# Altium project PCB工程.PrjPCB
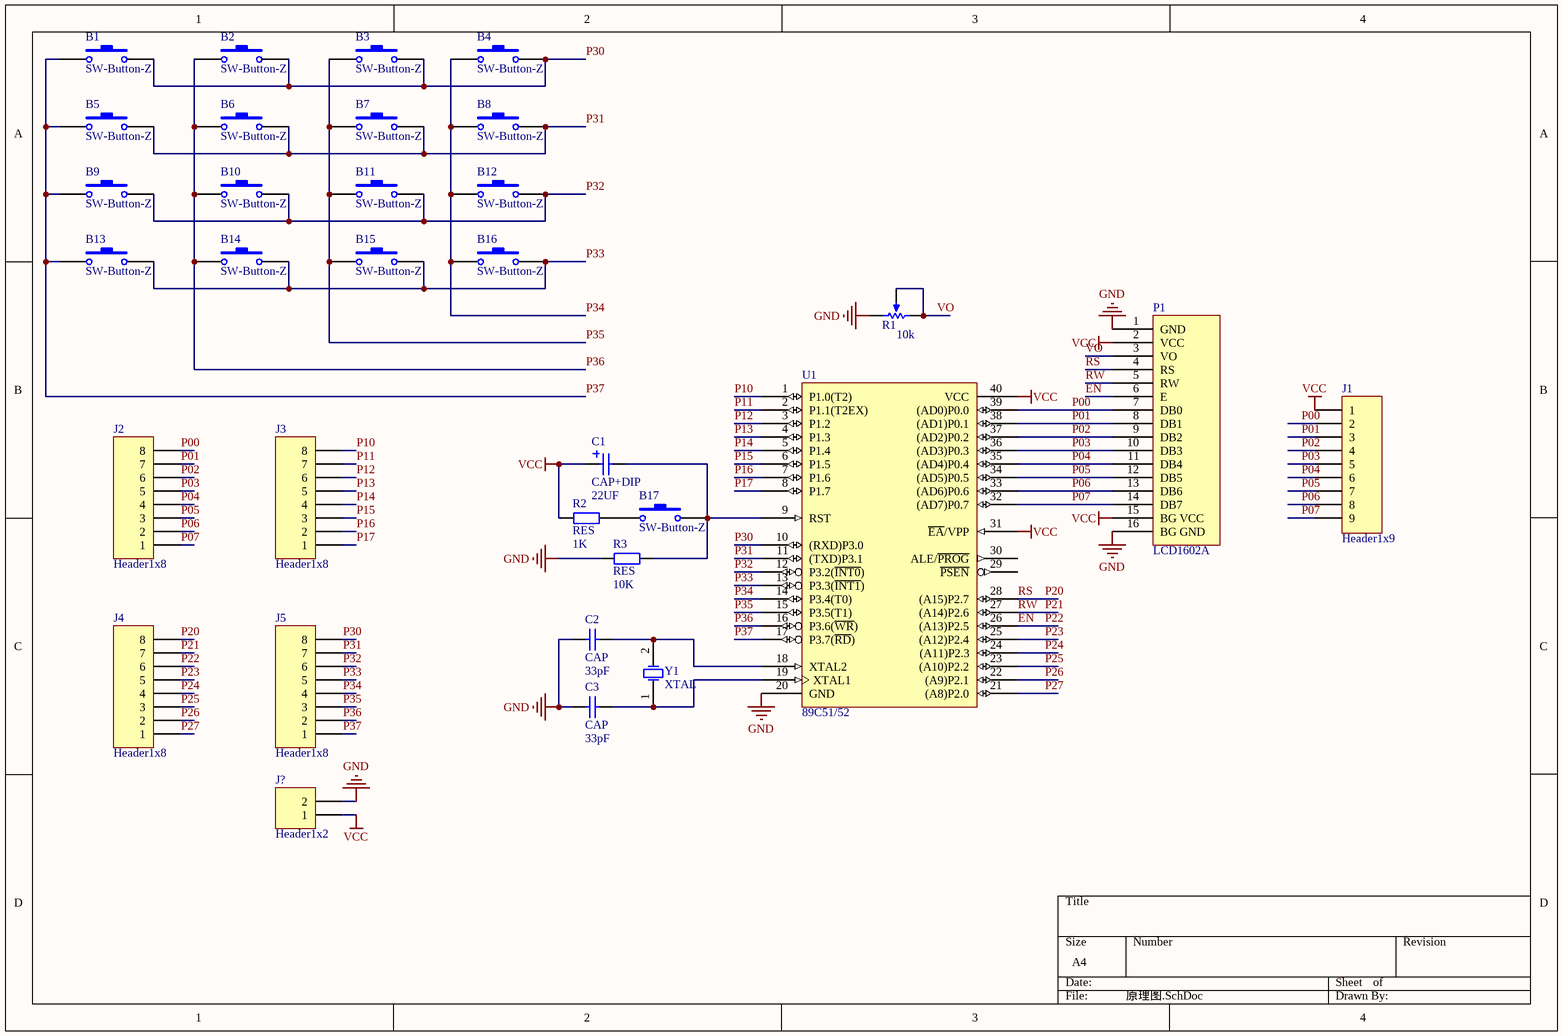
[diagram p0: 原理图.SchDoc]
1 sheet, 32 parts. Net scope: global (net labels, ports and power ports of the same name join across sheets).
Board file: PCB图.PcbDoc

## Sheet 原理图.SchDoc
size A4

### Parts
B1  SW-Button-Z  [SW-PB-Z]
B2  SW-Button-Z  [SW-PB-Z]
B3  SW-Button-Z  [SW-PB-Z]
B4  SW-Button-Z  [SW-PB-Z]
B5  SW-Button-Z  [SW-PB-Z]
B6  SW-Button-Z  [SW-PB-Z]
B7  SW-Button-Z  [SW-PB-Z]
B8  SW-Button-Z  [SW-PB-Z]
B9  SW-Button-Z  [SW-PB-Z]
B10  SW-Button-Z  [SW-PB-Z]
B11  SW-Button-Z  [SW-PB-Z]
B12  SW-Button-Z  [SW-PB-Z]
B13  SW-Button-Z  [SW-PB-Z]
B14  SW-Button-Z  [SW-PB-Z]
B15  SW-Button-Z  [SW-PB-Z]
B16  SW-Button-Z  [SW-PB-Z]
B17  SW-Button-Z  [SW-PB-Z]
C1  CAP+DIP  [CAP+DIP]
C2  CAP  [CAP]
C3  CAP  [CAP]
J1  Header1x9  [HEADER1X9]
J2  Header1x8  [HEADER1X8]
J3  Header1x8  [HEADER1X8]
J4  Header1x8  [HEADER1X8]
J5  Header1x8  [HEADER1X8]
J?  Header1x2  [HEADER1X2]
P1  LCD1602A  [LCD1602A]
R1  RES  [RES-Change-T]  (value not drawn)
R2  RES  [RES]
R3  RES  [RES]
U1  89C51/52  [DIP-40]
Y1  XTAL  [XTAL]

### Nets
GND: C2.1 C3.1 J?.2 P1.1(GND) P1.16(BG_GND) R1.2(BOT) R3.1 U1.20(GND)
VCC: C1.1 J1.1 J?.1 P1.2(VCC) P1.15(BG_VCC) R2.1 U1.31(~{EA}/VPP) U1.40(VCC)
EN: J4.6 P1.6(E) U1.26((A13)P2.5)  [also labelled P22]
P00: J1.2 J2.8 P1.7(DB0) U1.39((AD0)P0.0)
P01: J1.3 J2.7 P1.8(DB1) U1.38((AD1)P0.1)
P02: J1.4 J2.6 P1.9(DB2) U1.37((AD2)P0.2)
P03: J1.5 J2.5 P1.10(DB3) U1.36((AD3)P0.3)
P04: J1.6 J2.4 P1.11(DB4) U1.35((AD4)P0.4)
P05: J1.7 J2.3 P1.12(DB5) U1.34((AD5)P0.5)
P06: J1.8 J2.2 P1.13(DB6) U1.33((AD6)P0.6)
P07: J1.9 J2.1 P1.14(DB7) U1.32((AD7)P0.7)
P10: J3.8 U1.1(P1.0(T2))
P11: J3.7 U1.2(P1.1(T2EX))
P12: J3.6 U1.3(P1.2)
P13: J3.5 U1.4(P1.3)
P14: J3.4 U1.5(P1.4)
P15: J3.3 U1.6(P1.5)
P16: J3.2 U1.7(P1.6)
P17: J3.1 U1.8(P1.7)
P20: J4.8 P1.4(RS) U1.28((A15)P2.7)  [also labelled RS]
P21: J4.7 P1.5(RW) U1.27((A14)P2.6)  [also labelled RW]
P23: J4.5 U1.25((A12)P2.4)
P24: J4.4 U1.24((A11)P2.3)
P25: J4.3 U1.23((A10)P2.2)
P26: J4.2 U1.22((A9)P2.1)
P27: J4.1 U1.21((A8)P2.0)
P30: B1.2 B2.2 B3.2 B4.2 J5.8 U1.10((RXD)P3.0)
P31: B5.2 B6.2 B7.2 B8.2 J5.7 U1.11((TXD)P3.1)
P32: B9.2 B10.2 B11.2 B12.2 J5.6 U1.12(P3.2(~{INT0}))
P33: B13.2 B14.2 B15.2 B16.2 J5.5 U1.13(P3.3(~{INT1}))
P34: B4.1 B8.1 B12.1 B16.1 J5.4 U1.14(P3.4(T0))
P35: B3.1 B7.1 B11.1 B15.1 J5.3 U1.15(P3.5(T1))
P36: B2.1 B6.1 B10.1 B14.1 J5.2 U1.16(P3.6(~{WR}))
P37: B1.1 B5.1 B9.1 B13.1 J5.1 U1.17(P3.7(~{RD}))
VO: P1.3(VO) R1.1(TOP) R1.3(TAP)
NetB17_1: B17.1 R2.2
NetB17_2: B17.2 C1.2 R3.2 U1.9(RST)
NetC2_2: C2.2 U1.18(XTAL2) Y1.2(OSC2)
NetC3_2: C3.2 U1.19(XTAL1) Y1.1(OSC1)

Not connected (* = marked no-connect by the designer): U1 29(~{PSEN}) 30(ALE/~{PROG})

### Notes on the sheet
- (in symbol CAP) 33pF
- (in symbol CAP+DIP) 22UF
- (in symbol RES) 1K; 10K
- (in symbol RES-Change-T) 10k

### Library data of the parts
R1 = RES-Change-T